# Altium schematic sheet Schematic_Altium.SchDoc
size A4
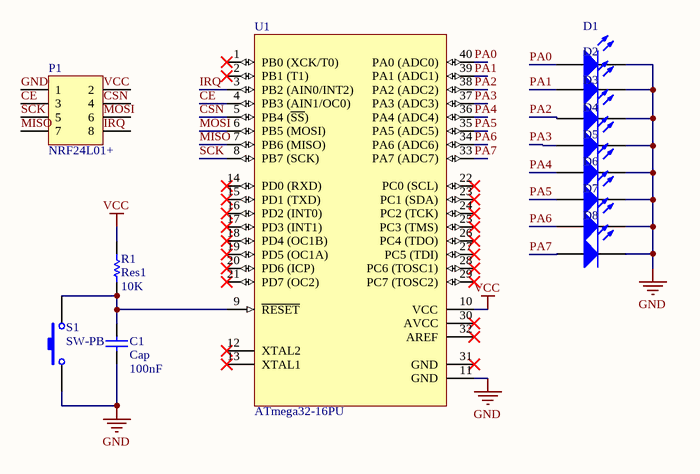
[diagram p0: Schematic_Altium.SchDoc]

## Parts
C1  Cap  value 100nF  [RAD-0.3]
D1  LED0  [LED-0]  (value not drawn)
D2  LED0  [LED-0]  (value not drawn)
D3  LED0  [LED-0]  (value not drawn)
D4  LED0  [LED-0]  (value not drawn)
D5  LED0  [LED-0]  (value not drawn)
D6  LED0  [LED-0]  (value not drawn)
D7  LED0  [LED-0]  (value not drawn)
D8  LED0  [LED-0]  (value not drawn)
P1  NRF24L01+  [HDR2X4]
R1  Res1  value 10K  [AXIAL-0.3]
S1  SW-PB  [SPST-2]
U1  ATmega32-16PU  [40P6]

## Nets
GND: C1.1 D1.2(K) D2.2(K) D3.2(K) D4.2(K) D5.2(K) D6.2(K) D7.2(K) D8.2(K) P1.1 S1.1 U1.11(GND)
VCC: R1.2 U1.10(VCC)
CE: P1.3 U1.4(PB3_(AIN1/OC0))
CSN: U1.5(PB4_(~{SS}))
IRQ: U1.3(PB2_(AIN0/INT2))
MISO: P1.7 U1.7(PB6_(MISO))
MOSI: U1.6(PB5_(MOSI))
PA0: D1.1(A) U1.40(PA0_(ADC0))
PA1: D2.1(A) U1.39(PA1_(ADC1))
PA2: D3.1(A) U1.38(PA2_(ADC2))
PA3: U1.37(PA3_(ADC3))
PA4: D5.1(A) U1.36(PA4_(ADC4))
PA5: D6.1(A) U1.35(PA5_(ADC5))
PA6: D7.1(A) U1.34(PA6_(ADC6))
PA7: D8.1(A) U1.33(PA7_(ADC7))
SCK: P1.5 U1.8(PB7_(SCK))
NetC1_2: C1.2 R1.1 S1.2 U1.9(~{RESET})

Not connected (* = marked no-connect by the designer): D4 1(A); P1 2 4 6 8; U1 1(PB0_(XCK/T0))* 2(PB1_(T1))* 12(XTAL2)* 13(XTAL1)* 14(PD0_(RXD))* 15(PD1_(TXD))* 16(PD2_(INT0))* 17(PD3_(INT1))* 18(PD4_(OC1B))* 19(PD5_(OC1A))* 20(PD6_(ICP))* 21(PD7_(OC2))* 22(PC0_(SCL))* 23(PC1_(SDA))* 24(PC2_(TCK))* 25(PC3_(TMS))* 26(PC4_(TDO))* 27(PC5_(TDI))* 28(PC6_(TOSC1))* 29(PC7_(TOSC2))* 30(AVCC)* 31(GND)* 32(AREF)*

## Notes on the sheet
- Labels drawn without touching a wire or pin: CSN, IRQ, MOSI, VCC

## Library data of the parts
C1 = Cap: Capacitor; Published: 8-Jun-2000; LatestRevisionDate: 17-Jul-2002; LatestRevisionNote: Re-released for DXP Platform.; PackageReference: RAD-0.3; Publisher: Altium Limited
D1-D8 = LED0: Typical INFRARED GaAs LED; Published: 8-Jun-2000; LatestRevisionDate: 08-Jul-2005; LatestRevisionNote: Mech Layer 1 removed.; PackageReference: LED-0; Publisher: Altium Limited
P1 = Header 4X2: Header, 4-Pin, Dual row; LatestRevisionDate: 17-Jul-2002; LatestRevisionNote: Re-released for DXP Platform.; Publisher: Altium Limited
R1 = Res1: Resistor; Published: 8-Jun-2000; LatestRevisionDate: 17-Jul-2002; LatestRevisionNote: Re-released for DXP Platform.; PackageReference: AXIAL-0.3; Publisher: Altium Limited
S1 = SW-PB: Switch; Published: 24-Mar-1999; LatestRevisionDate: 17-Jul-2002; LatestRevisionNote: Re-released for DXP Platform.; PackageReference: SPST-2; Publisher: Altium Limited
U1 = ATmega32-16PU: 8-bit AVR Microcontroller, 4.5-5.5V, 16MHz, 32KB Flash, 1024 Bytes EEPROM, 2KB SRAM, 40-pin PDIP, Industrial Grade (-40°C to 85°C); DatasheetVersion: revQ, Feb-2011; PackageVersion: revB, Sep-2001; PackageReference: 40P6; PackageDescription: 40-lead (0.600"/15.24mm Wide) Plastic Dual Inline Package (PDIP); Code_JEDEC: MS-011-AC; ComponentLink1Description: Manufacturer URL; ComponentLink1URL: http://www.atmel.com/; ComponentLink2Description: ATmega32(L) Datasheet; ComponentLink2URL: http://atmel.com/dyn/resources/prod_documents/doc2503.pdf; ComponentLink3Description: ATmega32(L) Summary; ComponentLink3URL: http://atmel.com/dyn/resources/prod_documents/2503S.pdf